# Altium schematic sheet breakout_board.SchDoc: Breakout Board
size A4; Engineer: Andrew Cook; Organization: Badgerloop; Address1: 133 Engineering Research; Address2: Building; Address3: Madison, WI 53715; DocumentNumber: 1; Revision: 1; SheetNumber: 1
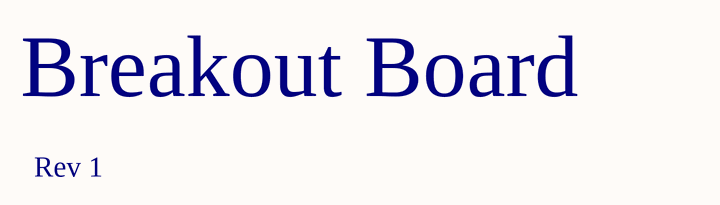
[diagram p0: breakout_board.SchDoc]

## Notes on the sheet
- Breakout Board
- Rev 1
- Title
- Size:
- Date:
- A4
- Number:
- Time:
- Revision:
- Sheet
- of
- File: